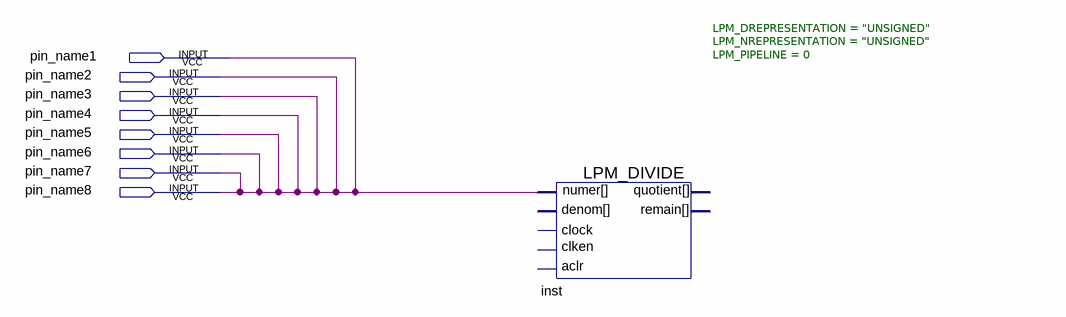
[diagram p0: schematic sheet]
// Quartus schematic display_8bits.bdf as structural Verilog: 1 symbols, 8 pins
module display_8bits (
  input  pin_name1,
  input  pin_name2,
  input  pin_name3,
  input  pin_name4,
  input  pin_name5,
  input  pin_name6,
  input  pin_name7,
  input  pin_name8
);

  LPM_DIVIDE #(.LPM_DREPRESENTATION("UNSIGNED"), .LPM_NREPRESENTATION("UNSIGNED"), .LPM_PIPELINE(0)) inst (.numer(pin_name1));  // open: denom, clock, clken, aclr, quotient, remain

  assign pin_name2 = pin_name1;
  assign pin_name3 = pin_name1;
  assign pin_name4 = pin_name1;
  assign pin_name5 = pin_name1;
  assign pin_name6 = pin_name1;
  assign pin_name7 = pin_name1;
  assign pin_name8 = pin_name1;
endmodule
